# Altium project gearposition.PrjPcb
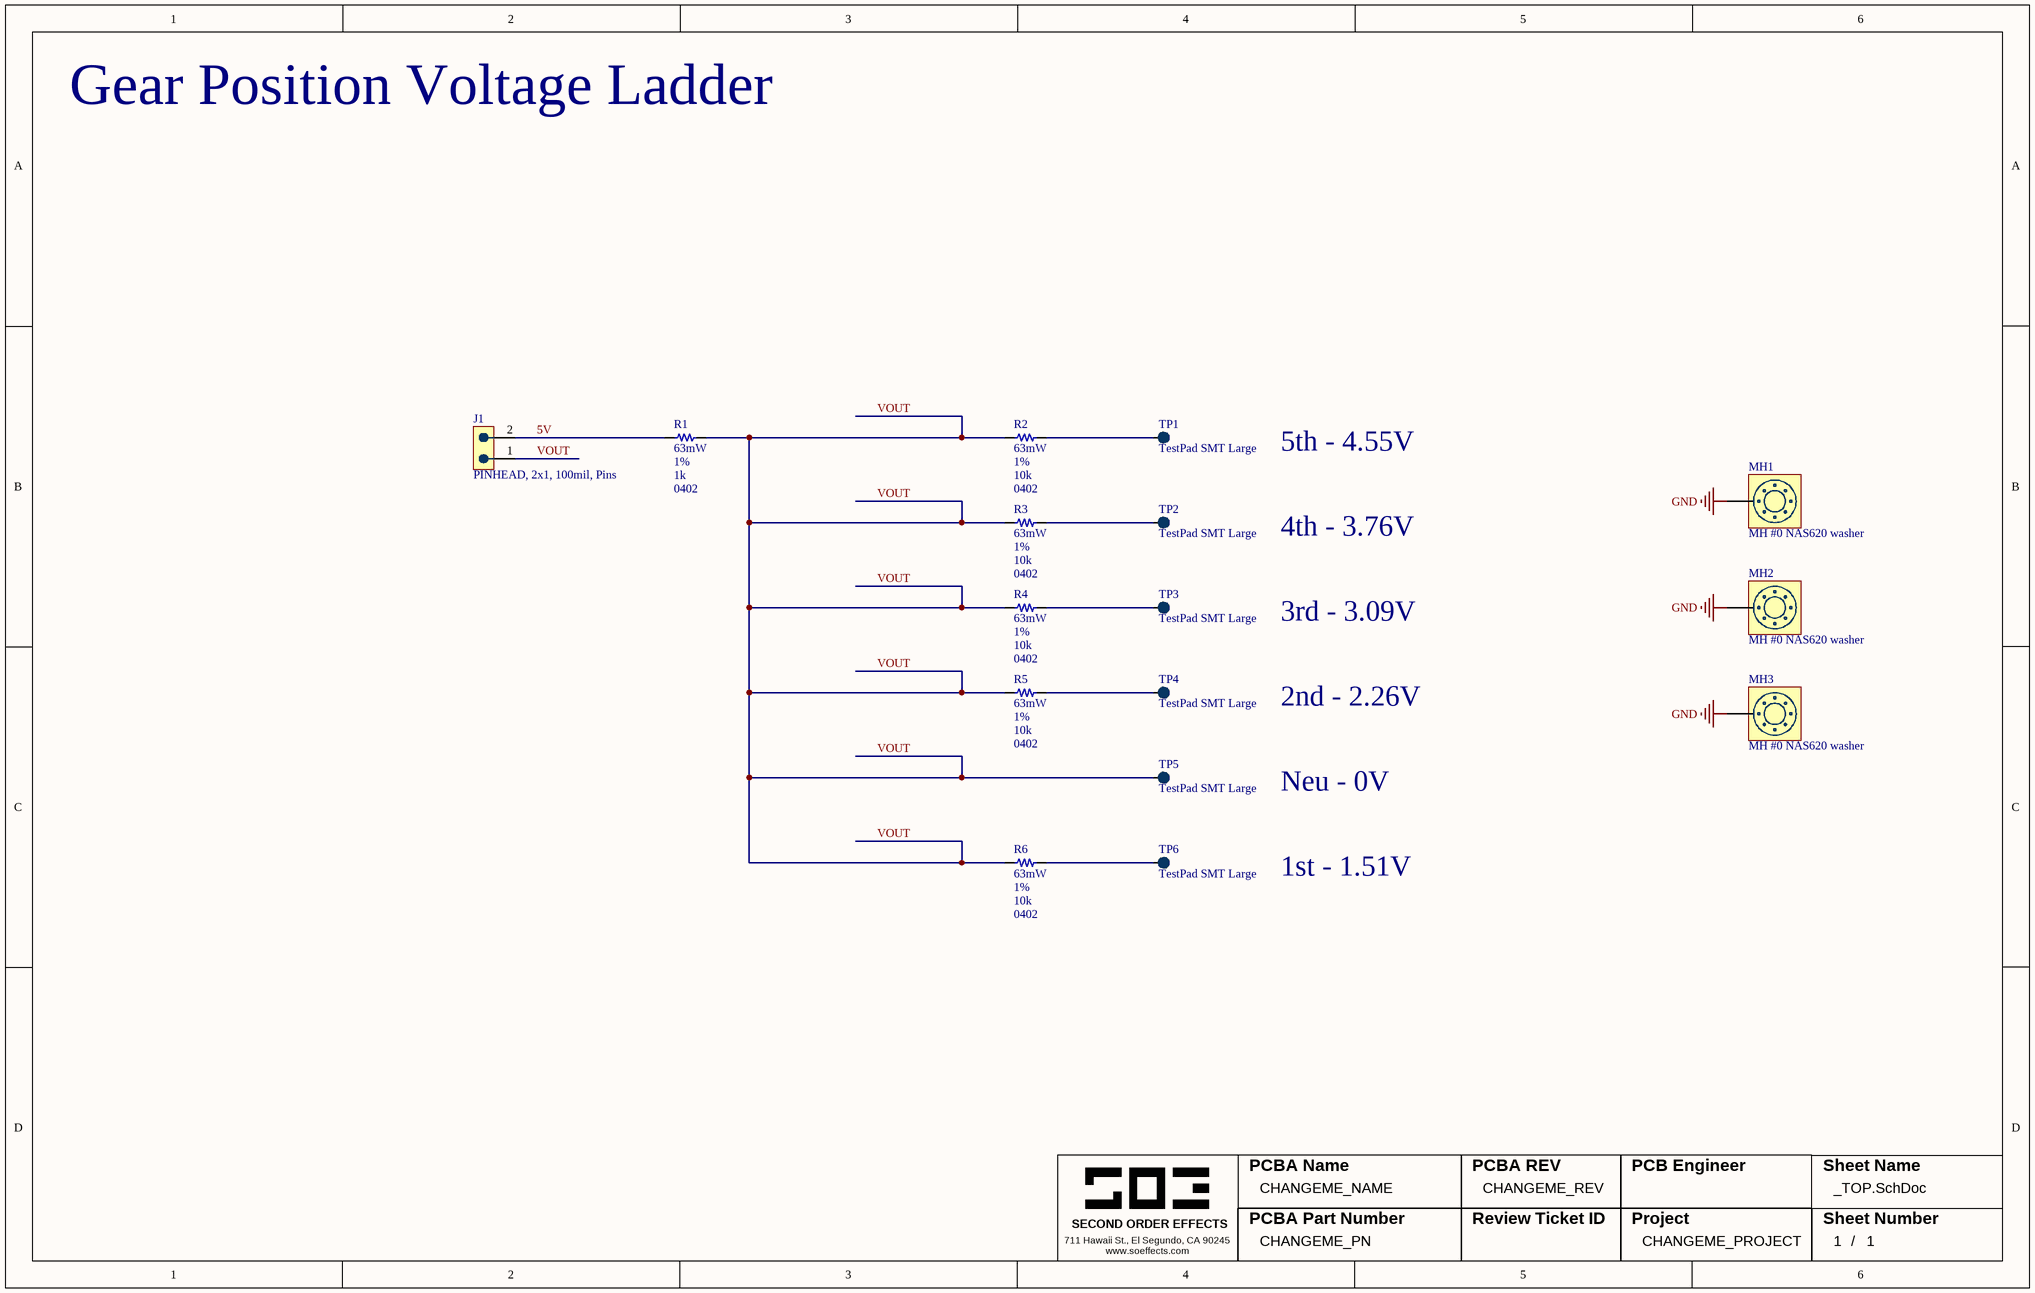
[diagram p0: _TOP.SchDoc]
PCB_PN: CHANGEME_PN; PCB_REV: CHANGEME_REV; PCBA_Name: CHANGEME_NAME; PCBA_PN: CHANGEME_PN; PCBA_REV: CHANGEME_REV; Project: CHANGEME_PROJECT
1 sheet, 16 parts. Net scope: global (net labels, ports and power ports of the same name join across sheets).
Board file: PCB1.PcbDoc

## Sheet _TOP.SchDoc
size B; SheetNumber: 1; SheetTotal: 1

### Parts
J1  PINHEAD, 2x1, 100mil, Pins  [PINHEAD 2 x 1 100MIL PIN]
MH1  MH #0 NAS620 washer  [MH_0_NAS620]  (no BOM)
MH2  MH #0 NAS620 washer  [MH_0_NAS620]  (no BOM)
MH3  MH #0 NAS620 washer  [MH_0_NAS620]  (no BOM)
R1  Power Rating: 63mW  Tolerance: 1%  Resistance: 1k  Case/Package: 0402  [R_0402]  (hidden comment: R 0402 1.00k 1% 0.063W ±100PPM/°C 50V AEC-Q200)
R2  Power Rating: 63mW  Tolerance: 1%  Resistance: 10k  Case/Package: 0402  [R_0402]  (hidden comment: R 0402 10.0k 1% 0.063W ±100PPM/°C 50V AEC-Q200)
R3  Power Rating: 63mW  Tolerance: 1%  Resistance: 10k  Case/Package: 0402  [R_0402]  (hidden comment: R 0402 10.0k 1% 0.063W ±100PPM/°C 50V AEC-Q200)
R4  Power Rating: 63mW  Tolerance: 1%  Resistance: 10k  Case/Package: 0402  [R_0402]  (hidden comment: R 0402 10.0k 1% 0.063W ±100PPM/°C 50V AEC-Q200)
R5  Power Rating: 63mW  Tolerance: 1%  Resistance: 10k  Case/Package: 0402  [R_0402]  (hidden comment: R 0402 10.0k 1% 0.063W ±100PPM/°C 50V AEC-Q200)
R6  Power Rating: 63mW  Tolerance: 1%  Resistance: 10k  Case/Package: 0402  [R_0402]  (hidden comment: R 0402 10.0k 1% 0.063W ±100PPM/°C 50V AEC-Q200)
TP1  TestPad SMT Large  [TEST_POINT_SMD_LARGE]  (no BOM)
TP2  TestPad SMT Large  [TEST_POINT_SMD_LARGE]  (no BOM)
TP3  TestPad SMT Large  [TEST_POINT_SMD_LARGE]  (no BOM)
TP4  TestPad SMT Large  [TEST_POINT_SMD_LARGE]  (no BOM)
TP5  TestPad SMT Large  [TEST_POINT_SMD_LARGE]  (no BOM)
TP6  TestPad SMT Large  [TEST_POINT_SMD_LARGE]  (no BOM)

### Nets
GND: MH1.1(MH) MH2.1(MH) MH3.1(MH)
5V: J1.2 R1.2
VOUT: J1.1 R1.1 R2.2 R3.2 R4.2 R5.2 R6.2 TP5.1(TP)
NetR2_1: R2.1 TP1.1(TP)
NetR3_1: R3.1 TP2.1(TP)
NetR4_1: R4.1 TP3.1(TP)
NetR5_1: R5.1 TP4.1(TP)
NetR6_1: R6.1 TP6.1(TP)

### Notes on the sheet
- Gear Position Voltage Ladder
- 5th - 4.55V
- 4th - 3.76V
- 3rd - 3.09V
- 2nd - 2.26V
- Neu - 0V
- 1st - 1.51V
- PCBA Name
- PCBA REV
- PCB Engineer
- Sheet Name
- www.soeffects.com
- 711 Hawaii St., El Segundo, CA 90245
- SECOND ORDER EFFECTS
- PCBA Part Number
- Review Ticket ID
- Project
- Sheet Number
- /

### Library data of the parts
J1 = CMP-ROOT-00005-3: Headers & Wire Housings 2.54MM CGRIDIII HDR 2P VERT SR SEL AU; Number of Positions: 2; Current Rating: 3A; Pitch: 2.54; Glow Wire Compliant: Non-compliant; Max Voltage Rating (DC): 350.35; Voltage Rating: 350; Housing Color: Black; Material: Brass; Max Operating Temperature: 125 C; Min Operating Temperature: -55 C; Termination: Solder; Pins: 2; Contact Gender: Pins; Lead Pitch: 2.54mm; Package Quantity: 6000; Number of Contacts: 2; Case/Package: Through-hole; Contact Plating: Gold; Color: Black; Mount: Through Hole; Number of Circuits: 2; Radiation Hardening: No; Orientation: Straight; Gender: Pins; REACH SVHC: Unknown; Number of Rows: 1; RoHS: Yes; Housing Material: Polyester; Packaging: Tray; Contact Material: Brass,Copper,Gold
MH1-MH3 = CMP-ROOT-00064-2: Mount: TH; Case/Package: #0; RoHS: Yes
R1 = CMP-08898-2: SMD Resistor, Thick Film, Automotive; Qualification: AEC-Q200; Composition: Thick Film; Min Operating Temperature: -55°C; Temperature Coefficient: ±100ppm/°C; Voltage Rating: 50V; Max Operating Temperature: 155°C; RoHS: Compliant
R2-R6 = CMP-09036-2: SMD Resistor, Thick Film, Automotive; Temperature Coefficient: ±100ppm/°C; Composition: Thick Film; RoHS: Compliant; Max Operating Temperature: 155°C; Voltage Rating: 50V; Min Operating Temperature: -55°C; Qualification: AEC-Q200
TP1-TP6 = CMP-ROOT-00011-5: Test pad 2mm; Pins: 1; Case/Package: 2mm; RoHS: Yes; Mount: SMD

## Assembly variants
All Fitted: all parts fitted
Production: not fitted J1 J?